# Altium schematic sheet connectors-dribbler.SchDoc
size A4; SheetNumber: 12; SheetTotal: 14
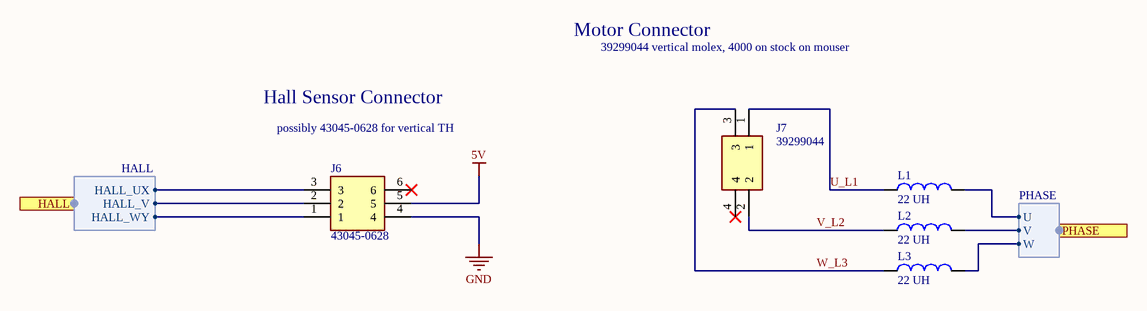
[diagram p0: connectors-dribbler.SchDoc]

## Parts
J6  43045-0628  [430450628]
J7  39299044  [39299044]
L1  22 UH  [EATON _HCM1A1307V2-220-R]
L2  22 UH  [EATON _HCM1A1307V2-220-R]
L3  22 UH  [EATON _HCM1A1307V2-220-R]

## Ports
HALL (harness HALL), PHASE (harness PHASE)

## Harnesses
PHASE: U, V, W
HALL: HALL_UX, HALL_WY, HALL_V

## Nets
5V: J6.5
GND: J6.4
U_L1: J7.1 L1.1
V_L2: J7.2 L2.1
W_L3: J7.3 L3.1
NetJ6_1: J6.1 ; port HALL.HALL_WY
NetJ6_2: J6.2 ; port HALL.HALL_V
NetJ6_3: J6.3 ; port HALL.HALL_UX
NetL1_2: L1.2 ; port PHASE.U
NetL2_2: L2.2 ; port PHASE.V
NetL3_2: L3.2 ; port PHASE.W

Not connected (* = marked no-connect by the designer): J6 6*; J7 4*

## Notes on the sheet
- Motor Connector
- 39299044 vertical molex, 4000 on stock on mouser
- Hall Sensor Connector
- possibly 43045-0628 for vertical TH

## Library data of the parts
J6 = CN HDR 6POS Molex 43045-0628: Molex 43045-0628 6POS Microfit / dual row, Vertical; Supplier 1: Digi-Key; Supplier Part Number 1: WM10679-ND; Part Number: CN HDR 6POS Molex 43045-0628; Supplier URL 1: https://www.digikey.ca/en/products/detail/molex/0430450628/3310200?s=N4IgTCBcDaICwGYAMcCsSBsYAcAdXIAugL5A; Pin Count: 6; Manufacturer Part Number 1: 430450628
J7 = CN HDR 4POS Molex 39299044 VERT: Molex 39299044 4POS Minifit / dual row, vertical; Supplier 1: Digi-Key; Supplier Part Number 1: WM7336-ND; Part Number: CN HDR 4POS Molex 39299044 VERT; Supplier URL 1: https://www.digikey.ca/en/products/detail/molex/0039299044/1624292?s=N4IgTCBcDaIOoFkDsBmFA2AtAOQCIgF0BfIA; Pin Count: 4; Manufacturer Part Number 1: 39299044
L1-L3 = IND 22UH 6A 33.1 mOHM SMD: Automotive Grade High Current Power Inductor 22uH 6A 28.8mOhm 5MHz SRF 2-Pin Surface Mount T/R; Manufacturer Part Number 1: HCM1A1307V2-220-R; Part Number: IND 22UH 6A 33.1 mOHM SMD; Supplier 1: Digi-Key; Supplier Part Number 1: 283-HCM1A1307V2-220-RCT-ND; Supplier URL 1: https://www.digikey.ca/en/products/detail/eaton-electronics-division/HCM1A1307V2-220-R/10479205?s=N4IgTCBcDa4BwGYC0AJAwgWQIwEEsIAYB2ANTCTDAKQCU0AVJAOQBEQBdAXyA; Value: 22 uH